# Altium schematic sheet Switch_PHY.SchDoc
size A3
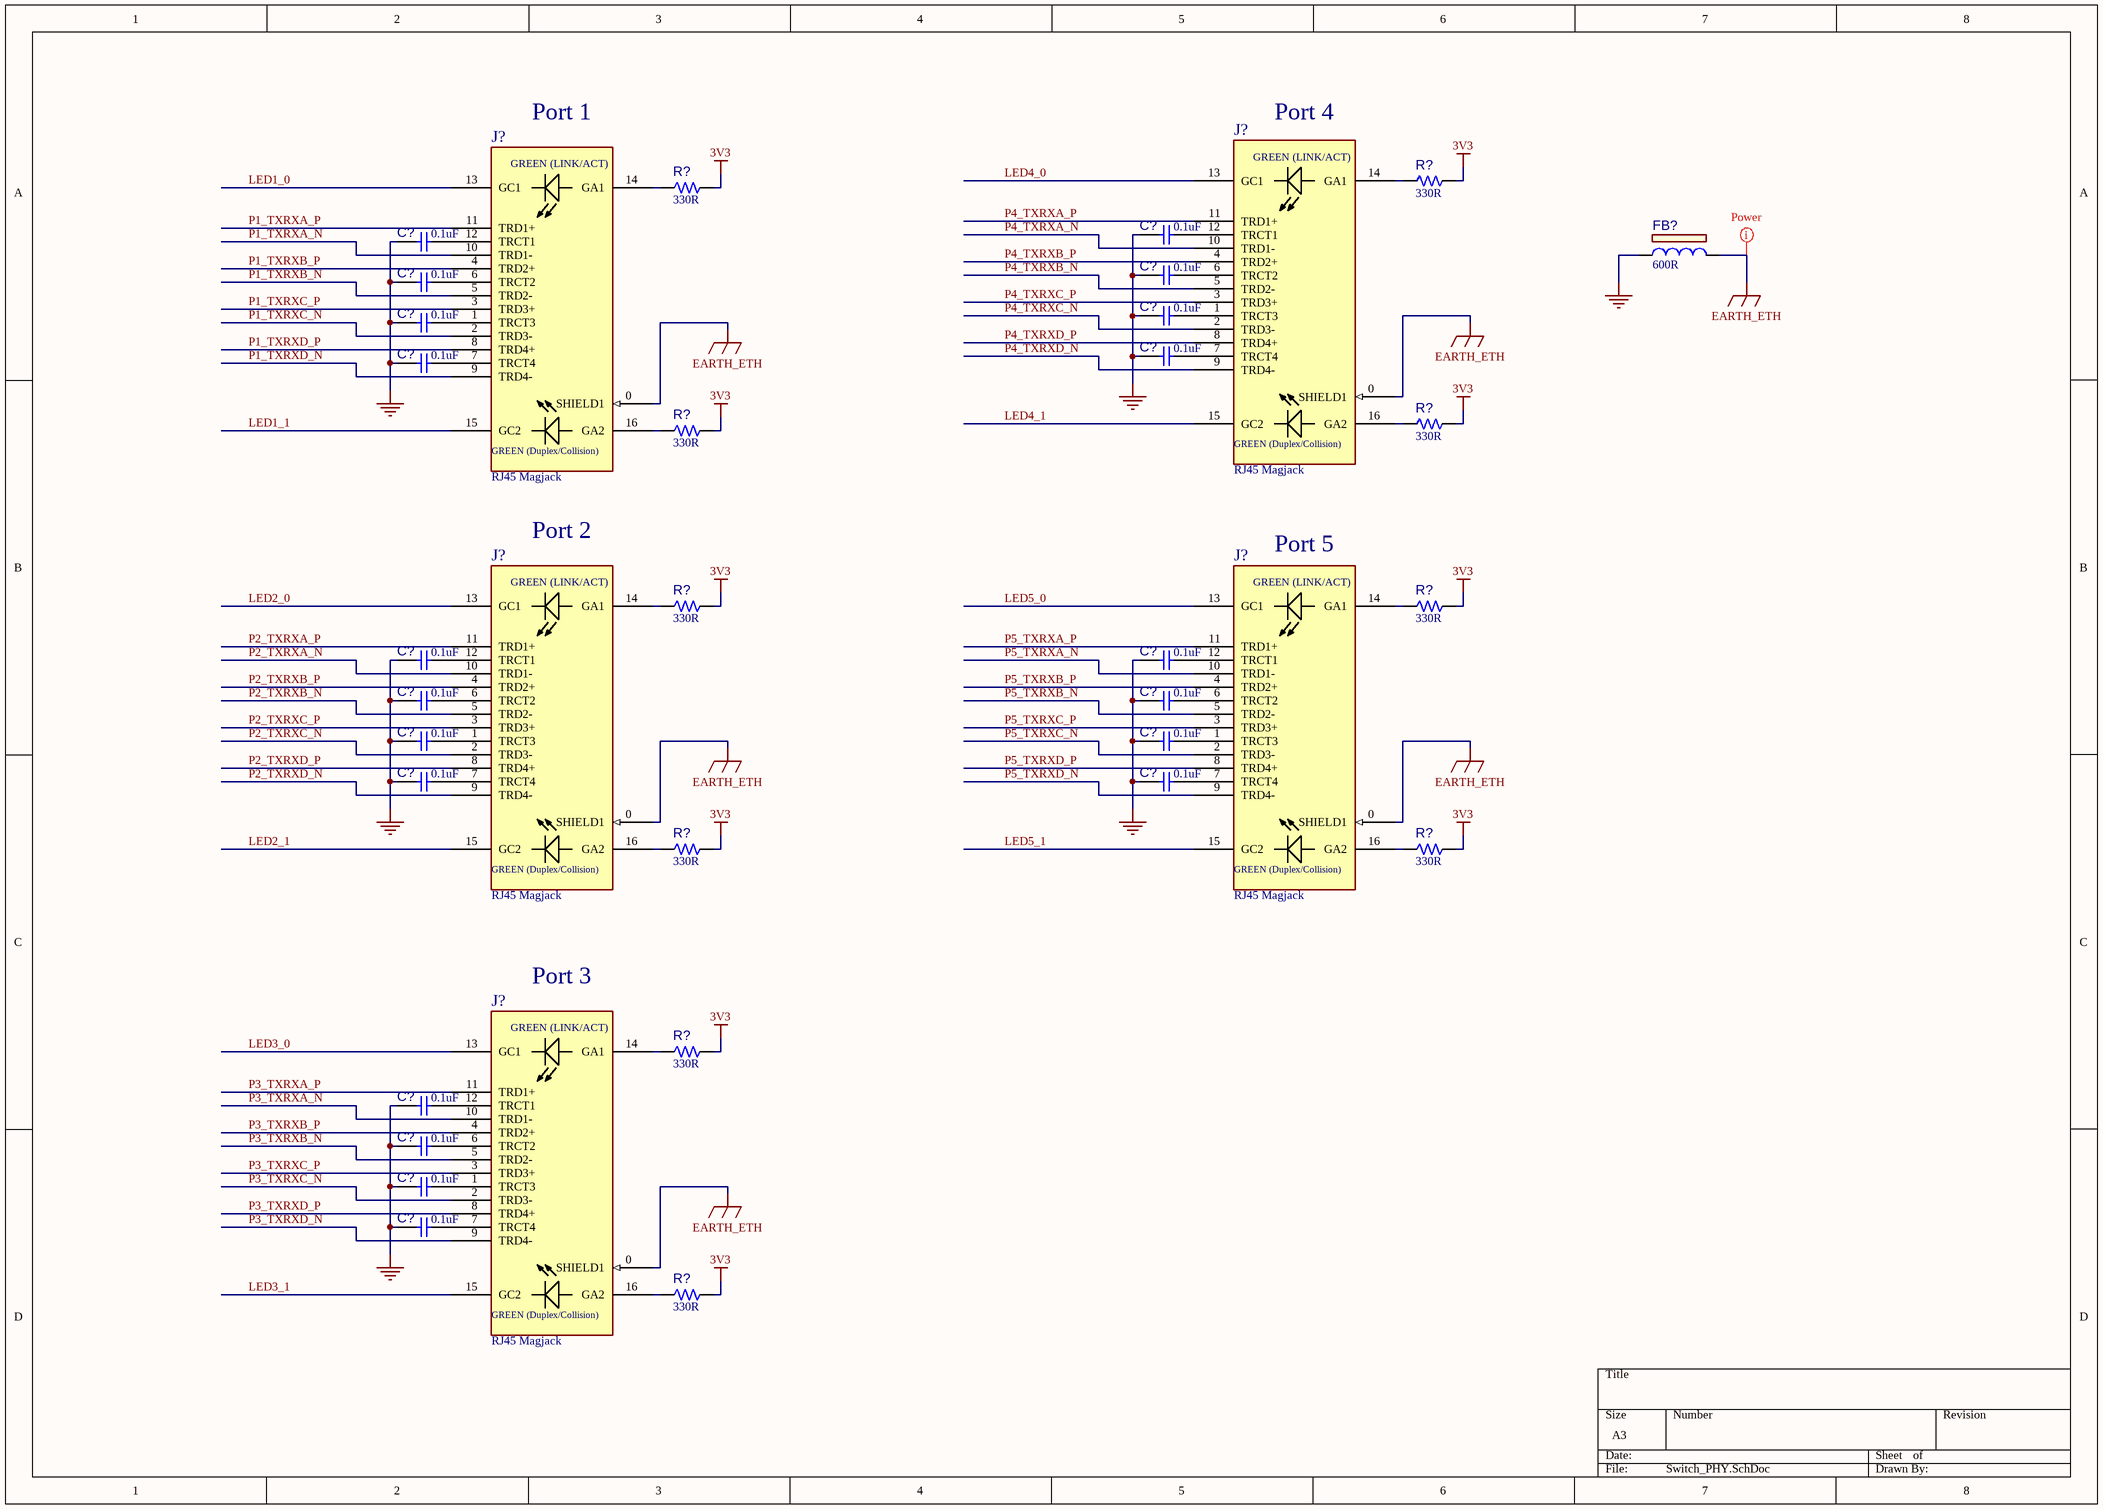
[diagram p0: Switch_PHY.SchDoc]

## Parts
(Parts that share a designator on the sheet are numbered #1, #2 ... from top to bottom, then left to right.)
C?#1  value 0.1uF  [CAP_C_0402]  (hidden comment: Capacitor NP)
C?#2  value 0.1uF  [CAP_C_0402]  (hidden comment: Capacitor NP)
C?#3  value 0.1uF  [CAP_C_0402]  (hidden comment: Capacitor NP)
C?#4  value 0.1uF  [CAP_C_0402]  (hidden comment: Capacitor NP)
C?#5  value 0.1uF  [CAP_C_0402]  (hidden comment: Capacitor NP)
C?#6  value 0.1uF  [CAP_C_0402]  (hidden comment: Capacitor NP)
C?#7  value 0.1uF  [CAP_C_0402]  (hidden comment: Capacitor NP)
C?#8  value 0.1uF  [CAP_C_0402]  (hidden comment: Capacitor NP)
C?#9  value 0.1uF  [CAP_C_0402]  (hidden comment: Capacitor NP)
C?#10  value 0.1uF  [CAP_C_0402]  (hidden comment: Capacitor NP)
C?#11  value 0.1uF  [CAP_C_0402]  (hidden comment: Capacitor NP)
C?#12  value 0.1uF  [CAP_C_0402]  (hidden comment: Capacitor NP)
C?#13  value 0.1uF  [CAP_C_0402]  (hidden comment: Capacitor NP)
C?#14  value 0.1uF  [CAP_C_0402]  (hidden comment: Capacitor NP)
C?#15  value 0.1uF  [CAP_C_0402]  (hidden comment: Capacitor NP)
C?#16  value 0.1uF  [CAP_C_0402]  (hidden comment: Capacitor NP)
C?#17  value 0.1uF  [CAP_C_0402]  (hidden comment: Capacitor NP)
C?#18  value 0.1uF  [CAP_C_0402]  (hidden comment: Capacitor NP)
C?#19  value 0.1uF  [CAP_C_0402]  (hidden comment: Capacitor NP)
C?#20  value 0.1uF  [CAP_C_0402]  (hidden comment: Capacitor NP)
FB?  value 600R  [IND_C_0805]  (hidden comment: Ferrite Bead)
J?#1  RJ45 Magjack  [CON_MODULAR_RJ45_TH_RA_RJMG2012211A0FR]
J?#2  RJ45 Magjack  [CON_MODULAR_RJ45_TH_RA_RJMG2012211A0FR]
J?#3  RJ45 Magjack  [CON_MODULAR_RJ45_TH_RA_RJMG2012211A0FR]
J?#4  RJ45 Magjack  [CON_MODULAR_RJ45_TH_RA_RJMG2012211A0FR]
J?#5  RJ45 Magjack  [CON_MODULAR_RJ45_TH_RA_RJMG2012211A0FR]
R?#1  value 330R  [RES_C_0603]  (hidden comment: Resistor)
R?#2  value 330R  [RES_C_0603]  (hidden comment: Resistor)
R?#3  value 330R  [RES_C_0603]  (hidden comment: Resistor)
R?#4  value 330R  [RES_C_0603]  (hidden comment: Resistor)
R?#5  value 330R  [RES_C_0603]  (hidden comment: Resistor)
R?#6  value 330R  [RES_C_0603]  (hidden comment: Resistor)
R?#7  value 330R  [RES_C_0603]  (hidden comment: Resistor)
R?#8  value 330R  [RES_C_0603]  (hidden comment: Resistor)
R?#9  value 330R  [RES_C_0603]  (hidden comment: Resistor)
R?#10  value 330R  [RES_C_0603]  (hidden comment: Resistor)

## Nets
3V3: R?#1.2 R?#2.2 R?#3.2 R?#4.2 R?#5.2 R?#6.2 R?#7.2 R?#8.2 R?#9.2 R?#10.2
EARTH_ETH: FB?.2 J?#1.0(SHIELD1) J?#2.0(SHIELD1) J?#3.0(SHIELD1) J?#4.0(SHIELD1) J?#5.0(SHIELD1)
GND: C?#1.2 C?#2.2 C?#3.2 C?#4.2 C?#5.2 C?#6.2 C?#7.2 C?#8.2 C?#9.2 C?#10.2 C?#11.2 C?#12.2 C?#13.2 C?#14.2 C?#15.2 C?#16.2 C?#17.2 C?#18.2 C?#19.2 C?#20.2 FB?.1
LED1_0: J?#2.13(GC1)
LED1_1: J?#2.15(GC2)
LED2_0: J?#3.13(GC1)
LED2_1: J?#3.15(GC2)
LED3_0: J?#5.13(GC1)
LED3_1: J?#5.15(GC2)
LED4_0: J?#1.13(GC1)
LED4_1: J?#1.15(GC2)
LED5_0: J?#4.13(GC1)
LED5_1: J?#4.15(GC2)
P1_TXRXA_N: J?#2.10(TRD1-)
P1_TXRXA_P: J?#2.11(TRD1+)
P1_TXRXB_N: J?#2.5(TRD2-)
P1_TXRXB_P: J?#2.4(TRD2+)
P1_TXRXC_N: J?#2.2(TRD3-)
P1_TXRXC_P: J?#2.3(TRD3+)
P1_TXRXD_N: J?#2.9(TRD4-)
P1_TXRXD_P: J?#2.8(TRD4+)
P2_TXRXA_N: J?#3.10(TRD1-)
P2_TXRXA_P: J?#3.11(TRD1+)
P2_TXRXB_N: J?#3.5(TRD2-)
P2_TXRXB_P: J?#3.4(TRD2+)
P2_TXRXC_N: J?#3.2(TRD3-)
P2_TXRXC_P: J?#3.3(TRD3+)
P2_TXRXD_N: J?#3.9(TRD4-)
P2_TXRXD_P: J?#3.8(TRD4+)
P3_TXRXA_N: J?#5.10(TRD1-)
P3_TXRXA_P: J?#5.11(TRD1+)
P3_TXRXB_N: J?#5.5(TRD2-)
P3_TXRXB_P: J?#5.4(TRD2+)
P3_TXRXC_N: J?#5.2(TRD3-)
P3_TXRXC_P: J?#5.3(TRD3+)
P3_TXRXD_N: J?#5.9(TRD4-)
P3_TXRXD_P: J?#5.8(TRD4+)
P4_TXRXA_N: J?#1.10(TRD1-)
P4_TXRXA_P: J?#1.11(TRD1+)
P4_TXRXB_N: J?#1.5(TRD2-)
P4_TXRXB_P: J?#1.4(TRD2+)
P4_TXRXC_N: J?#1.2(TRD3-)
P4_TXRXC_P: J?#1.3(TRD3+)
P4_TXRXD_N: J?#1.9(TRD4-)
P4_TXRXD_P: J?#1.8(TRD4+)
P5_TXRXA_N: J?#4.10(TRD1-)
P5_TXRXA_P: J?#4.11(TRD1+)
P5_TXRXB_N: J?#4.5(TRD2-)
P5_TXRXB_P: J?#4.4(TRD2+)
P5_TXRXC_N: J?#4.2(TRD3-)
P5_TXRXC_P: J?#4.3(TRD3+)
P5_TXRXD_N: J?#4.9(TRD4-)
P5_TXRXD_P: J?#4.8(TRD4+)
NetC?#1_1: C?#1.1 J?#1.12(TRCT1)
NetC?#2_1: C?#2.1 J?#2.12(TRCT1)
NetC?#3_1: C?#3.1 J?#1.6(TRCT2)
NetC?#4_1: C?#4.1 J?#2.6(TRCT2)
NetC?#5_1: C?#5.1 J?#1.1(TRCT3)
NetC?#6_1: C?#6.1 J?#2.1(TRCT3)
NetC?#7_1: C?#7.1 J?#1.7(TRCT4)
NetC?#8_1: C?#8.1 J?#2.7(TRCT4)
NetC?#9_1: C?#9.1 J?#3.12(TRCT1)
NetC?#10_1: C?#10.1 J?#4.12(TRCT1)
NetC?#11_1: C?#11.1 J?#3.6(TRCT2)
NetC?#12_1: C?#12.1 J?#4.6(TRCT2)
NetC?#13_1: C?#13.1 J?#3.1(TRCT3)
NetC?#14_1: C?#14.1 J?#4.1(TRCT3)
NetC?#15_1: C?#15.1 J?#3.7(TRCT4)
NetC?#16_1: C?#16.1 J?#4.7(TRCT4)
NetC?#17_1: C?#17.1 J?#5.12(TRCT1)
NetC?#18_1: C?#18.1 J?#5.6(TRCT2)
NetC?#19_1: C?#19.1 J?#5.1(TRCT3)
NetC?#20_1: C?#20.1 J?#5.7(TRCT4)
NetJ?#1_14: J?#1.14(GA1) R?#1.1
NetJ?#1_16: J?#1.16(GA2) R?#3.1
NetJ?#2_14: J?#2.14(GA1) R?#2.1
NetJ?#2_16: J?#2.16(GA2) R?#4.1
NetJ?#3_14: J?#3.14(GA1) R?#5.1
NetJ?#3_16: J?#3.16(GA2) R?#7.1
NetJ?#4_14: J?#4.14(GA1) R?#6.1
NetJ?#4_16: J?#4.16(GA2) R?#8.1
NetJ?#5_14: J?#5.14(GA1) R?#9.1
NetJ?#5_16: J?#5.16(GA2) R?#10.1

## Layout directives
net class Power (VBUS): EARTH_ETH

## Notes on the sheet
- Port 1
- Port 4
- Port 2
- (near J?#4) Port 5
- Port 3
- (in symbol CON RJ-45 RJMG2012211A0FR) GREEN (LINK/ACT); GREEN (Duplex/Collision)

## Library data of the parts
C?#1-C?#20 = CAP1463: Capacitor; Manufacturer 1: TDK Corporation; Manufacturer Part Number 1: C1005X7R1H104K050BB; Voltage: 50V; Description_: CAP CER 0.1uF 50V 10% X7R SMD 0402; Dev Tools Status: Design; Tolerance: 10%; Temperature Coeffcient: X7R; Type: Ceramic; Owner: Jamus Griego; Populated: YES; MCHP-ID: CAP1463; Package: 0402; Revision: A; Status: MCL Design; ComponentLink1URL: https://chn-vm-apps.microchip.com/mchprepo/parts/Datasheets/TDKMLCCCapRange.pdf; ComponentLink1Description: Datasheets; Operating Temperature: -55C to +125C; Category: Capacitor; Supplier 1: Digi-Key; Supplier Part Number 1: 445-5932-1-ND; Quantity Override: 1
FB? = IND1162: Manufacturer 1: TDK Corporation; Manufacturer Part Number 1: MPZ2012S601AT000; Description_: FERRITE 2A 600R SMD 0805; Dev Tools Status: Production; Owner: Randolph Sobrepena; DCR: 100M; Test Frequency: 100MHz; Populated: YES; MCHP-ID: IND1162; Revision: 1; Symbol: Ferrite Bead; Status: MCL Design; ComponentLink1URL: https://chn-vm-apps.microchip.com/mchprepo/parts/Datasheets/beads_commercial_power_mpz_en; ComponentLink1Description: Datasheet; Package: 0805; Type: Ferrite Bead; Category: Inductor; Supplier 1: Digi-Key; Supplier Part Number 1: 445-2206-1-ND; Quantity Override: 1
J?#1-J?#5 = CON RJ-45 RJMG2012211A0FR: Manufacturer 1: Amphenol Commercial Products; Populated: Yes; Description_: CON MODULAR RJ45 MAGJACK TH R/A; Manufacturer Part Number 1: RJMG2012211A0FR; RoHS: RoHS Compliant; ComponentLink1URL: https://www.amphenolcanada.com/ProductSearch/Drawings/AC/RJMG2012211A0FR.PDF; ComponentLink1Description: Datasheet; Supplier 1: Digikey; Supplier Part Number 1: RJMG2012211A0FR-ND; Value: RJ45 Magjack
R?#1-R?#10 = RSMT0166: Manufacturer 1: Panasonic; Manufacturer Part Number 1: ERJ-3GEYJ331V; Tolerance: 5%; Description_: RES TKF 330R 5% 1/10W SMD 0603; Dev Tools Status: Production; Voltage: 75V; Temperature Coeffcient: 200ppm/C; Power: 1/10W; Populated: Yes; MCHP-ID: RSMT0166; Package: 0603; Revision: 1; Status: MCL Design; ComponentLink1URL: https://chn-vm-apps.microchip.com/mchprepo/parts/Datasheets/AOA0000CE1.pdf; ComponentLink1Description: Datasheet; Operating Temperature: -55C to +155C; Category: Resistor; Type: RES SMD; Composition: TKF; Manufacturer 2: KOA Speer; Manufacturer Part Number 2: RK73B1JTTD331J; Manufacturer 3: Stackpole Electronics Inc; Manufacturer Part Number 3: RMCF 1/16 330 5% R; Supplier 1: Digi-Key; Supplier Part Number 1: P330GTR-ND; Supplier 2: KOA Speer; Supplier Part Number 2: RK73B1JTTD331J; Supplier 3: Stackpole Electronics Inc; Supplier Part Number 3: RMCF 1/16 330 5% R; Quantity Override: 1